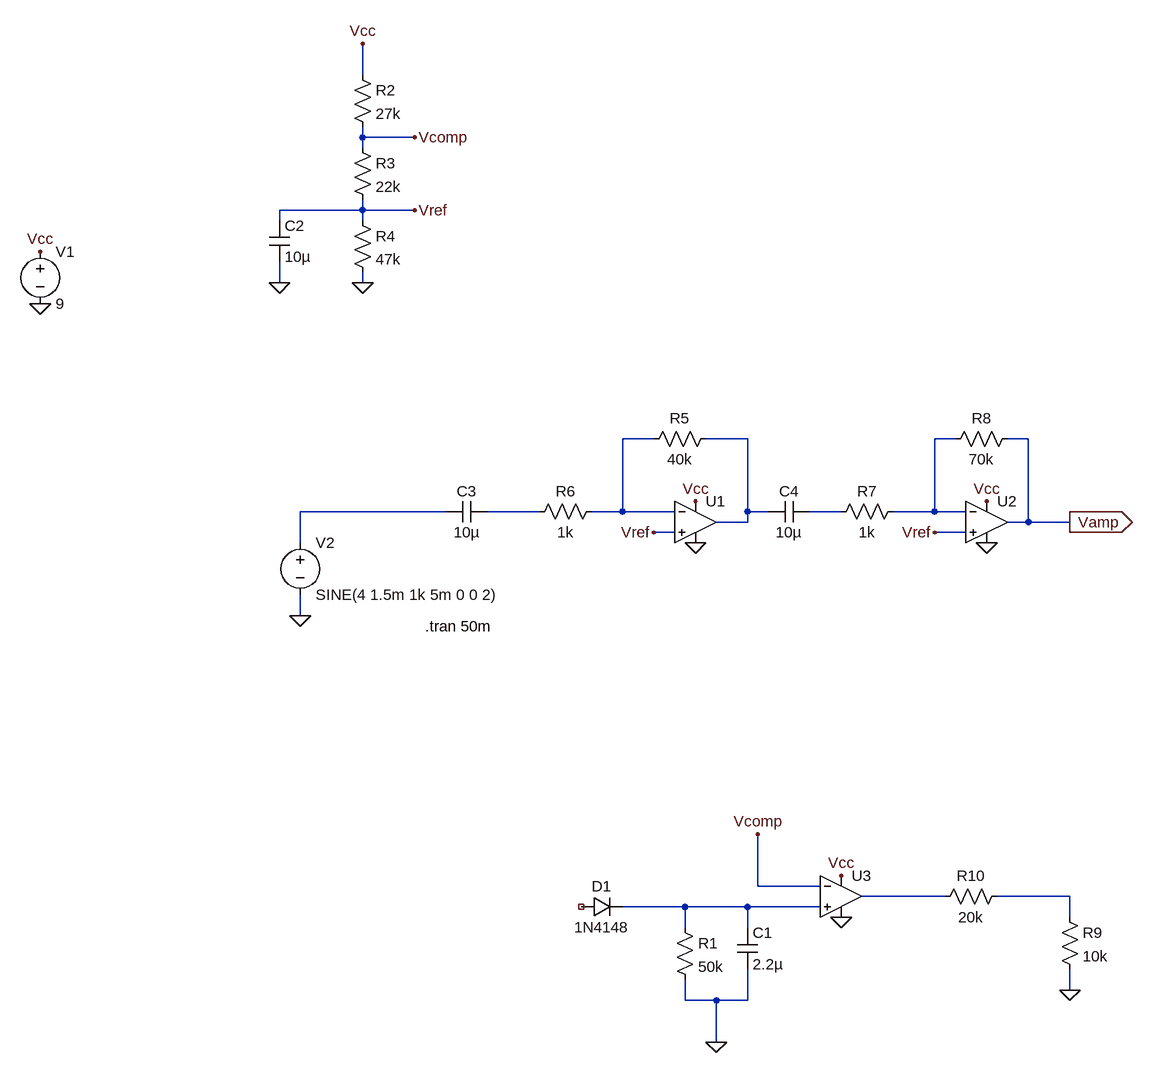
[diagram p0: schematic Untitled.asc]
Untitled.asc, the LTspice schematic file:
Version 4
SHEET 1 2048 1152
WIRE -160 -352 -160 -400
WIRE -160 -256 -160 -272
WIRE -80 -256 -160 -256
WIRE -160 -240 -160 -256
WIRE -160 -144 -160 -160
WIRE -160 -144 -288 -144
WIRE -80 -144 -160 -144
WIRE -288 -128 -288 -144
WIRE -160 -128 -160 -144
WIRE -288 -32 -288 -64
WIRE -160 -32 -160 -48
WIRE 288 208 240 208
WIRE 432 208 368 208
WIRE 752 208 720 208
WIRE 864 208 832 208
WIRE -32 320 -256 320
WIRE 112 320 32 320
WIRE 240 320 240 208
WIRE 240 320 192 320
WIRE 320 320 240 320
WIRE 432 320 432 208
WIRE 464 320 432 320
WIRE 576 320 528 320
WIRE 720 320 720 208
WIRE 720 320 656 320
WIRE 768 320 720 320
WIRE 432 336 432 320
WIRE 432 336 384 336
WIRE 864 336 864 208
WIRE 864 336 832 336
WIRE 928 336 864 336
WIRE 320 352 288 352
WIRE 768 352 720 352
WIRE -256 368 -256 320
WIRE -256 480 -256 448
WIRE 448 896 448 816
WIRE 544 896 448 896
WIRE 736 912 608 912
WIRE 928 912 816 912
WIRE 336 928 240 928
WIRE 432 928 336 928
WIRE 544 928 432 928
WIRE 928 944 928 912
WIRE 336 960 336 928
WIRE 432 960 432 928
WIRE 928 1056 928 1024
WIRE 336 1072 336 1040
WIRE 384 1072 336 1072
WIRE 432 1072 432 1024
WIRE 432 1072 384 1072
WIRE 384 1136 384 1072
FLAG 352 368 0
FLAG 800 368 0
FLAG -656 0 0
FLAG -656 -80 Vcc
FLAG 352 304 Vcc
FLAG 800 304 Vcc
FLAG -256 480 0
FLAG 288 352 Vref
FLAG 720 352 Vref
FLAG 384 1136 0
FLAG -160 -32 0
FLAG -160 -400 Vcc
FLAG -288 -32 0
FLAG -80 -144 Vref
FLAG -80 -256 Vcomp
FLAG 448 816 Vcomp
FLAG 576 880 Vcc
FLAG 576 944 0
FLAG 928 1056 0
FLAG 928 336 Vamp
IOPIN 928 336 Out
SYMBOL UniversalOpAmp2 352 336 R0
SYMATTR InstName U1
SYMBOL UniversalOpAmp2 800 336 R0
SYMATTR InstName U2
SYMBOL Res 384 192 R90
WINDOW 0 0 56 VBottom 2
WINDOW 3 32 56 VTop 2
SYMATTR InstName R5
SYMATTR Value 40k
SYMBOL Res 208 304 R90
WINDOW 0 0 56 VBottom 2
WINDOW 3 32 56 VTop 2
SYMATTR InstName R6
SYMATTR Value 1k
SYMBOL Res 672 304 R90
WINDOW 0 0 56 VBottom 2
WINDOW 3 32 56 VTop 2
SYMATTR InstName R7
SYMATTR Value 1k
SYMBOL Res 848 192 R90
WINDOW 0 0 56 VBottom 2
WINDOW 3 32 56 VTop 2
SYMATTR InstName R8
SYMATTR Value 70k
SYMBOL Cap 32 304 R90
WINDOW 0 0 32 VBottom 2
WINDOW 3 32 32 VTop 2
SYMATTR InstName C3
SYMATTR Value 10µ
SYMBOL Cap 528 304 R90
WINDOW 0 0 32 VBottom 2
WINDOW 3 32 32 VTop 2
SYMATTR InstName C4
SYMATTR Value 10µ
SYMBOL Voltage -656 -96 R0
SYMATTR InstName V1
SYMATTR Value 9
SYMBOL Voltage -256 352 R0
SYMATTR InstName V2
SYMATTR Value SINE(4 1.5m 1k 5m 0 0 2)
SYMBOL diode 176 944 R270
WINDOW 0 32 32 VTop 2
WINDOW 3 0 32 VBottom 2
SYMATTR InstName D1
SYMATTR Value 1N4148
SYMBOL Res 320 944 R0
SYMATTR InstName R1
SYMATTR Value 50k
SYMBOL Cap 416 960 R0
SYMATTR InstName C1
SYMATTR Value 2.2µ
SYMBOL Res -176 -368 R0
SYMATTR InstName R2
SYMATTR Value 27k
SYMBOL Res -176 -256 R0
SYMATTR InstName R3
SYMATTR Value 22k
SYMBOL Res -176 -144 R0
SYMATTR InstName R4
SYMATTR Value 47k
SYMBOL Cap -304 -128 R0
SYMATTR InstName C2
SYMATTR Value 10µ
SYMBOL UniversalOpAmp2 576 912 R0
SYMATTR InstName U3
SYMBOL Res 912 928 R0
SYMATTR InstName R9
SYMATTR Value 10k
SYMBOL Res 832 896 R90
WINDOW 0 0 56 VBottom 2
WINDOW 3 32 56 VTop 2
SYMATTR InstName R10
SYMATTR Value 20k
TEXT -64 496 Left 2 !.tran 50m

The netlist it stands for:
* Untitled.asc
XU1 Vref N001 Vcc 0 N002 level2 Avol=1Meg GBW=10Meg Slew=10Meg Ilimit=25m Rail=0 Vos=0 En=0 Enk=0 In=0 Ink=0 Rin=500Meg  ; pins In+ In- V+ V- OUT
XU2 Vref N003 Vcc 0 Vamp level2 Avol=1Meg GBW=10Meg Slew=10Meg Ilimit=25m Rail=0 Vos=0 En=0 Enk=0 In=0 Ink=0 Rin=500Meg  ; pins In+ In- V+ V- OUT
R5 N002 N001 40k
R6 N001 N005 1k
R7 N003 N006 1k
R8 Vamp N003 70k
C3 N005 N004 10µ
C4 N006 N002 10µ
V1 Vcc 0 9
V2 N004 0 SINE(4 1.5m 1k 5m 0 0 2)
D1 NC_01 N009 1N4148
R1 N009 0 50k
C1 N009 0 2.2µ
R2 Vcc Vcomp 27k
R3 Vcomp Vref 22k
R4 Vref 0 47k
C2 Vref 0 10µ
XU3 N009 Vcomp Vcc 0 N007 level2 Avol=1Meg GBW=10Meg Slew=10Meg Ilimit=25m Rail=0 Vos=0 En=0 Enk=0 In=0 Ink=0 Rin=500Meg  ; pins In+ In- V+ V- OUT
R9 N008 0 10k
R10 N008 N007 20k
.model D D
.lib standard.dio
.tran 50m
.lib UniversalOpAmp2.lib
.backanno
.end